# EAGLE design PowerBoard (EAGLE 9.3.0)

## Sheet 1 of 2
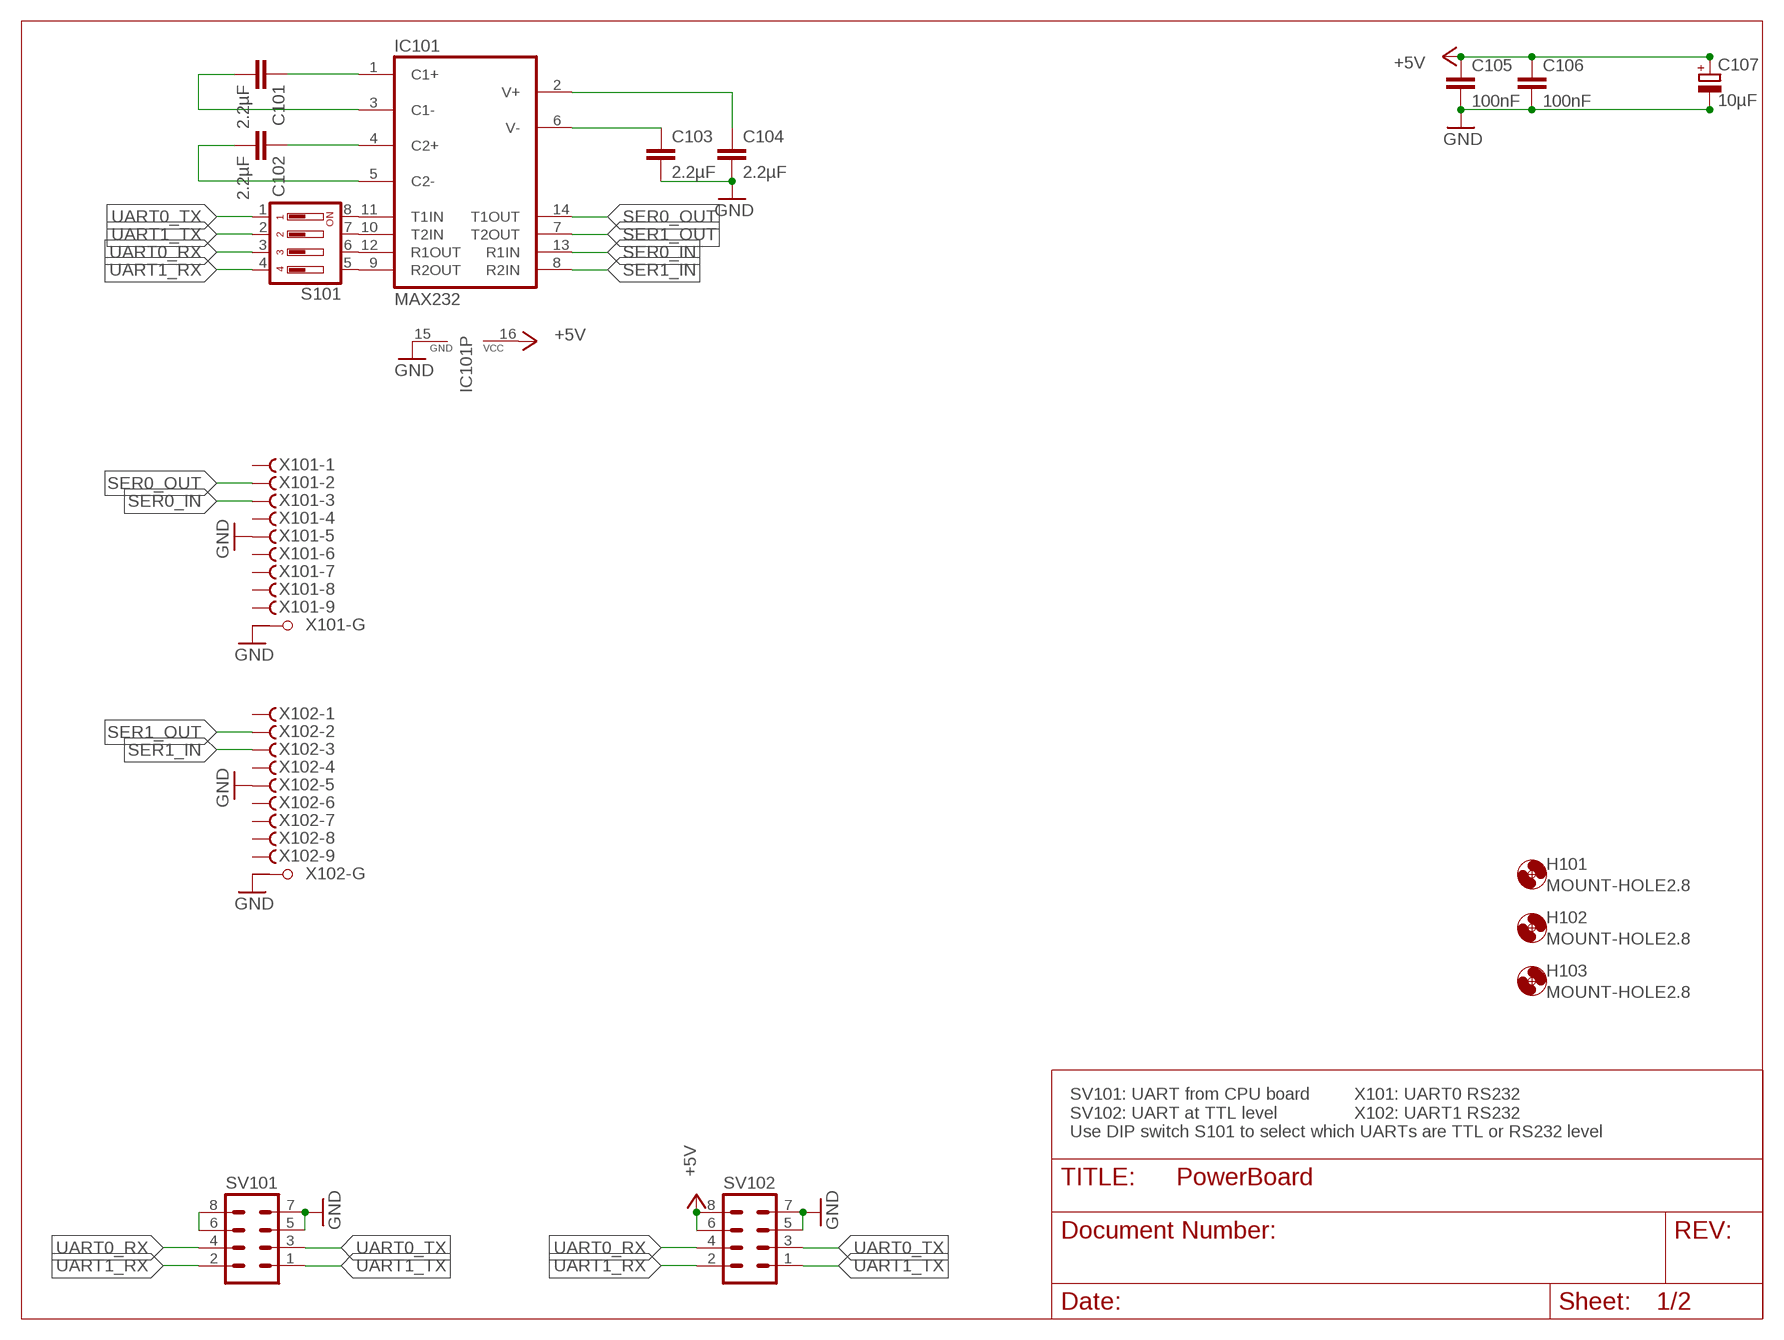
[diagram p0: schematic, sheet 1]

### Parts
C101  2.2µF  C-EUC0805  [C0805]
C102  2.2µF  C-EUC0805  [C0805]
C103  2.2µF  C-EUC0805  [C0805]
C104  2.2µF  C-EUC0805  [C0805]
C105  100nF  C-EUC0805  [C0805]
C106  100nF  C-EUC0805  [C0805]
C107  10µF  CPOL-EUSMCB  [SMC_B]
H101  MOUNT-HOLE2.8  [2,8]
H102  MOUNT-HOLE2.8  [2,8]
H103  MOUNT-HOLE2.8  [2,8]
IC101  MAX232  [DIL16]
S101  DP04  [DP-04]
SV101  MA04-2  [MA04-2]
SV102  MA04-2  [MA04-2]
X101  F09HPS  [F09HP]
X102  F09HPS  [F09HP]

### Nets
+5V: C105.1 C106.1 C107.+ IC101.16(VCC) SV102.6 SV102.8 ; also sheet 2
GND: C103.2 C104.2 C105.2 C106.2 C107.- IC101.15(GND) SV101.5 SV101.7 SV102.5 SV102.7 X101.5(-5:F) X101.G1(-G:G1) X102.5(-5:F) X102.G1(-G:G1) ; also sheet 2
N$1: C104.1 IC101.2(V+)
N$2: C103.1 IC101.6(V-)
N$3: C102.1 IC101.4(C2+)
N$4: C101.1 IC101.1(C1+)
N$5: SV101.6 SV101.8
N$6: IC101.9(R2OUT) S101.5
N$9: C102.2 IC101.5(C2-)
N$10: C101.2 IC101.3(C1-)
N$11: IC101.12(R1OUT) S101.6
N$12: IC101.10(T2IN) S101.7
N$13: IC101.11(T1IN) S101.8
SER0_IN: IC101.13(R1IN) X101.3(-3:F)
SER0_OUT: IC101.14(T1OUT) X101.2(-2:F)
SER1_IN: IC101.8(R2IN) X102.3(-3:F)
SER1_OUT: IC101.7(T2OUT) X102.2(-2:F)
UART0_RX: S101.3 SV101.4 SV102.4
UART0_TX: S101.1 SV101.3 SV102.3
UART1_RX: S101.4 SV101.2 SV102.2
UART1_TX: S101.2 SV101.1 SV102.1
Unconnected: X101.1(-1:F) X101.4(-4:F) X101.6(-6:F) X101.7(-7:F) X101.8(-8:F) X101.9(-9:F) X101.G2(-G:G2) X102.1(-1:F) X102.4(-4:F) X102.6(-6:F) X102.7(-7:F) X102.8(-8:F) X102.9(-9:F) X102.G2(-G:G2)

### Notes on the sheet
- SV101: UART from CPU board
  SV102: UART at TTL level
  Use DIP switch S101 to select which UARTs are TTL or RS232 level
- X101: UART0 RS232
  X102: UART1 RS232

## Sheet 2 of 2
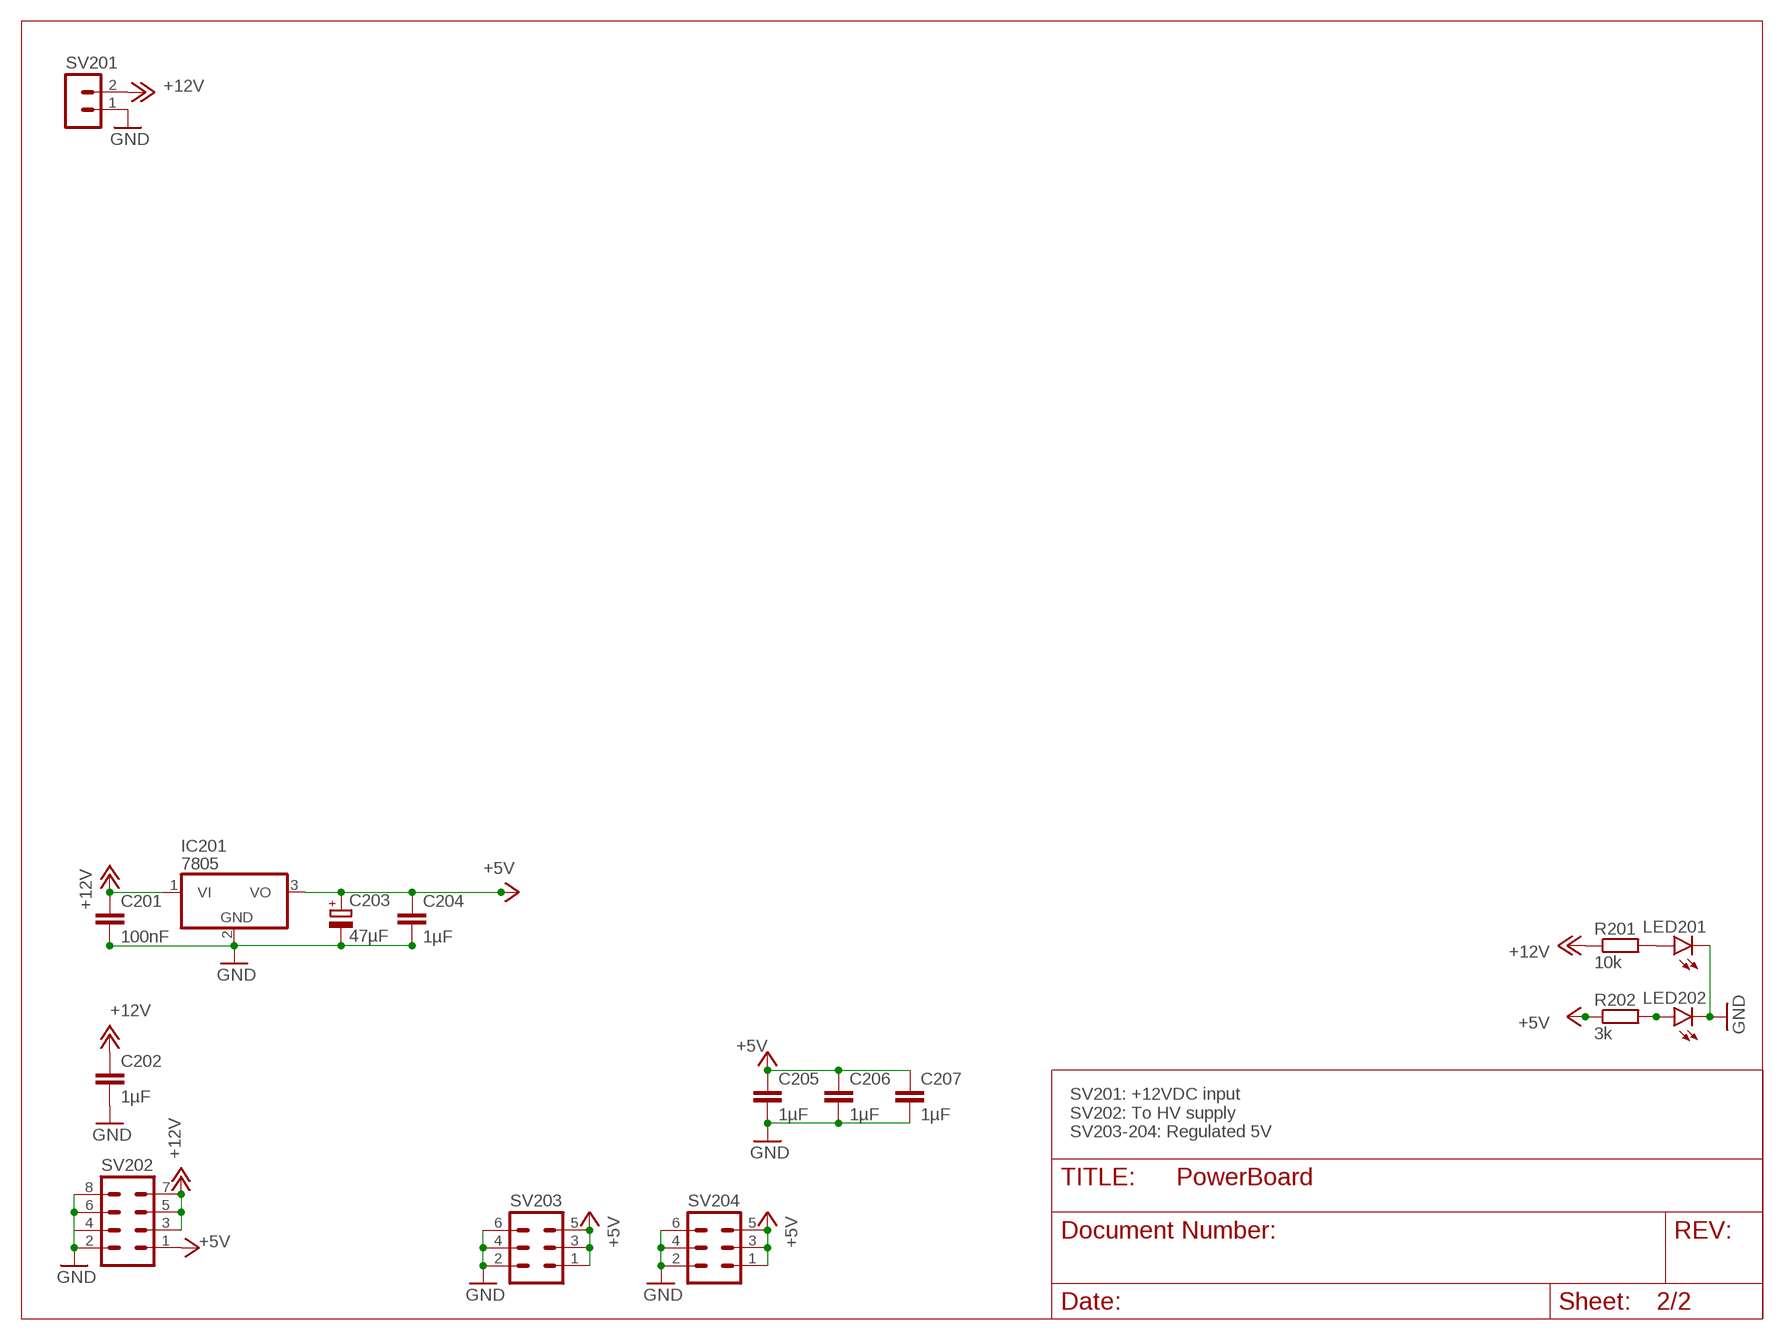
[diagram p1: schematic, sheet 2]

### Parts
C201  100nF  C-EUC0805  [C0805]
C202  1µF  C-EUC0805  [C0805]
C203  47µF  CPOL-EUCT6032  [CT6032]
C204  1µF  C-EUC0805  [C0805]
C205  1µF  C-EUC0805  [C0805]
C206  1µF  C-EUC0805  [C0805]
C207  1µF  C-EUC0805  [C0805]
IC201  7805  7805TV  [TO220V]
LED201  LEDCHIPLED_1206  [CHIPLED_1206]
LED202  LEDCHIPLED_1206  [CHIPLED_1206]
R201  10k  R-EU_R2012  [R2012]
R202  3k  R-EU_R2012  [R2012]
SV201  1792863  [1792863]
SV202  MA04-2  [MA04-2]
SV203  MA03-2  [MA03-2]
SV204  MA03-2  [MA03-2]

### Nets
+5V: C203.+ C204.1 C205.1 C206.1 C207.1 IC201.3(VO) R202.1 SV202.1 SV203.1 SV203.3 SV203.5 SV204.1 SV204.3 SV204.5 ; also sheet 1
+12V: C201.1 C202.1 IC201.1(VI) R201.1 SV201.2 SV202.3 SV202.5 SV202.7
GND: C201.2 C202.2 C203.- C204.2 C205.2 C206.2 C207.2 IC201.2(GND) LED201.C LED202.C SV201.1 SV202.2 SV202.4 SV202.6 SV202.8 SV203.2 SV203.4 SV203.6 SV204.2 SV204.4 SV204.6 ; also sheet 1
N$7: LED202.A R202.2
N$8: LED201.A R201.2

### Notes on the sheet
- SV201: +12VDC input
  SV202: To HV supply
  SV203-204: Regulated 5V

## Library data of the parts
C101-C104 = rcl:C-EU: CAPACITOR, European symbol; MOUSER: 710-885012107016; SPICEPREFIX: C
C105 C106 C201 = rcl:C-EU: CAPACITOR, European symbol; MOUSER: 710-885012207072; SPICEPREFIX: C
C107 = rcl:CPOL-EU: POLARIZED CAPACITOR, European symbol; MOUSER: 581-TAJB106K020RNJV; SPICEPREFIX: C
C202 C204-C207 = rcl:C-EU: CAPACITOR, European symbol; MOUSER: 710-885012107015; SPICEPREFIX: C
C203 = rcl:CPOL-EU: POLARIZED CAPACITOR, European symbol; MOUSER: 581-TAJD476M016RNJV; SPICEPREFIX: C
H101-H103 = holes:MOUNT-HOLE: MOUNTING HOLE with drill center marker
IC101 = maxim:MAX232: RS232 TRANSCEIVER; MF: MAXIM; MOUSER: 595-MAX232N; MPN: MAX232ACPE+; OC_FARNELL: 9723773; OC_NEWARK: 68K4544
IC201 = linear:78*: Positive VOLTAGE REGULATOR Source: http://cache.national.com/ds/LM/LM78L05.pdf http://www.fairchildsemi.com/ds/LM/LM7805.pdf; MOUSER: 490-VXO7805-1000
LED201 LED202 = led:LED: LED OSRAM: - CHIPLED LG R971, LG N971, LY N971, LG Q971, LY Q971, LO R971, LY R971 LH N974, LH R974 LS Q976, LO Q976, LY Q976 LO Q996 - Hyper CHIPLED LW Q18S LB Q993, LB Q99A, LB R99A - SideLED LS A670, LO A670, LY A670, LG A670, LP A670 LB A673, LV A673, LT A673, LW A673 LH A674 LY A675 LS A676, LA A676, LO A676, LY A676, LW A676 LS A679, LY A679, LG A679 - Hyper Micro SIDELED® LS Y876, LA Y876, LO Y876, LY Y876 LT Y87S - SmartLED LW L88C, LW L88S LB L89C, LB L89S, LG L890 LS L89K, LO L89K, LY L89K LS L896, LA L896, LO L896, LY L896 - TOPLED LS T670, LO T670, LY T670, LG T670, LP T670 LSG T670, LSP T670, LSY T670, LOP T670, LYG T670 LG T671, LOG T671, LSG T671 LB T673, LV T673, LT T673, LW T673 LH T674 LS T676, LA T676, LO T676, LY T676, LB T676, LH T676, LSB T676, LW T676 LB T67C, LV T67C, LT T67C, LS T67K, LO T67K, LY T67K, LW E67C LS E67B, LA E67B, LO E67B, LY E67B, LB E67C, LV E67C, LT E67C LW T67C LS T679, LY T679, LG T679 LS T770, LO T770, LY T770, LG T770, LP T770 LB T773, LV T773, LT T773, LW T773 LH T774 LS E675, LA E675, LY E675, LS T675 LS T776, LA T776, LO T776, LY T776, LB T776 LHGB T686 LT T68C, LB T68C - Hyper Mini TOPLED® LB M676 - Mini TOPLED Santana® LG M470 LS M47K, LO M47K, LY M47K Source: http://www.osram.convergy.de LUXEON: - LUMILED® LXK2-PW12-R00, LXK2-PW12-S00, LXK2-PW14-U00, LXK2-PW14-V00 LXK2-PM12-R00, LXK2-PM12-S00, LXK2-PM14-U00 LXK2-PE12-Q00, LXK2-PE12-R00, LXK2-PE12-S00, LXK2-PE14-T00, LXK2-PE14-U00 LXK2-PB12-K00, LXK2-PB12-L00, LXK2-PB12-M00, LXK2-PB14-N00, LXK2-PB14-P00, LXK2-PB14-Q00 LXK2-PR12-L00, LXK2-PR12-M00, LXK2-PR14-Q00, LXK2-PR14-R00 LXK2-PD12-Q00, LXK2-PD12-R00, LXK2-PD12-S00 LXK2-PH12-R00, LXK2-PH12-S00 LXK2-PL12-P00, LXK2-PL12-Q00, LXK2-PL12-R00 Source: www.luxeon.com KINGBRIGHT: KA-3528ASYC Source: www.kingbright.com; MOUSER: 710-156120YS75300
R201 = rcl:R-EU_: RESISTOR, European symbol; MOUSER: 652-CR0805FX-1002ELF; SPICEPREFIX: R
R202 = rcl:R-EU_: RESISTOR, European symbol; MOUSER: 652-CR0805JW-302ELF; SPICEPREFIX: R
S101 = switch-dil:DP04: DIL/CODE SWITCH; MOUSER: 611-BDB04; MPN: DP04; OC_FARNELL: 9471600; OC_NEWARK: 73J0027
SV101 SV102 SV202 = con-lstb:MA04-2: PIN HEADER; OC_FARNELL: unknown; OC_NEWARK: unknown
SV201 = Parts:1792863: PCB terminal block - PTS 1,5/ 2-5,0-H - 1792863 Footprint Proven Information <https://www.phoenixcontact.com/online/portal/us?uri=pxc-oc-itemdetail:pid=1792863&library=usen&tab=1>; MOUSER: 651-1792863
SV203 SV204 = con-lstb:MA03-2: PIN HEADER; OC_FARNELL: unknown; OC_NEWARK: unknown
X101 X102 = con-subd:F09HPS: SUB-D; OC_FARNELL: unknown; OC_NEWARK: unknown

## Net classes
0 default: width 0.203 mm

## Board
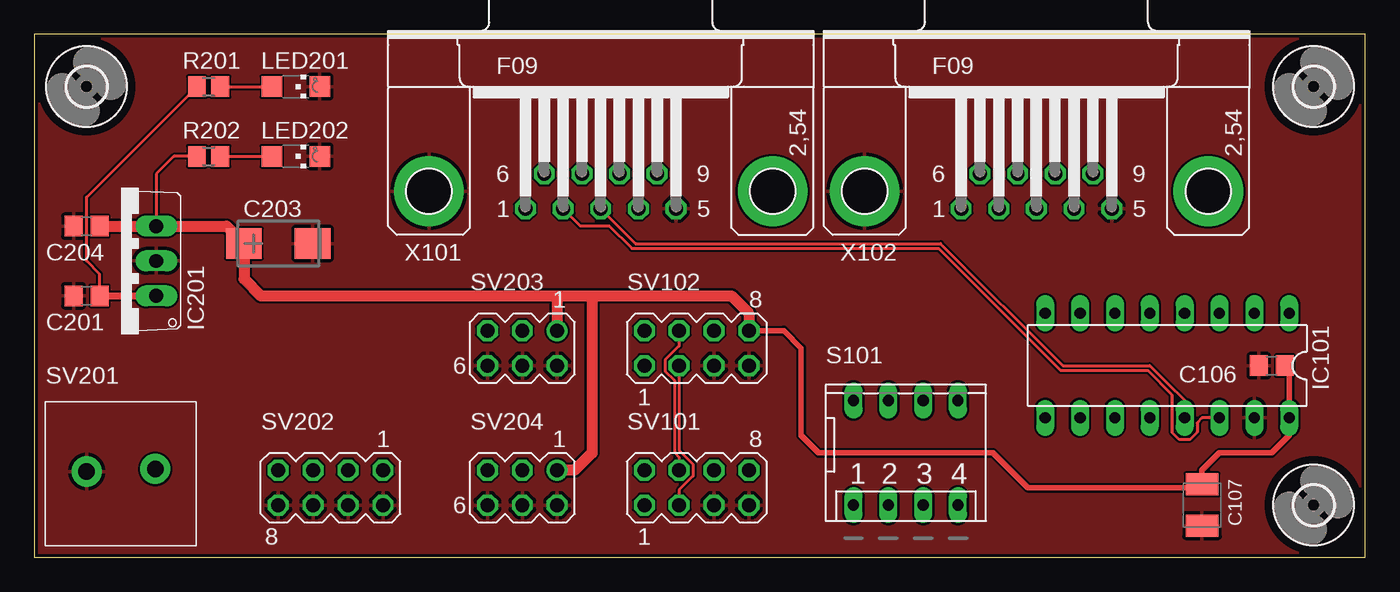
[diagram p2: board, top side]
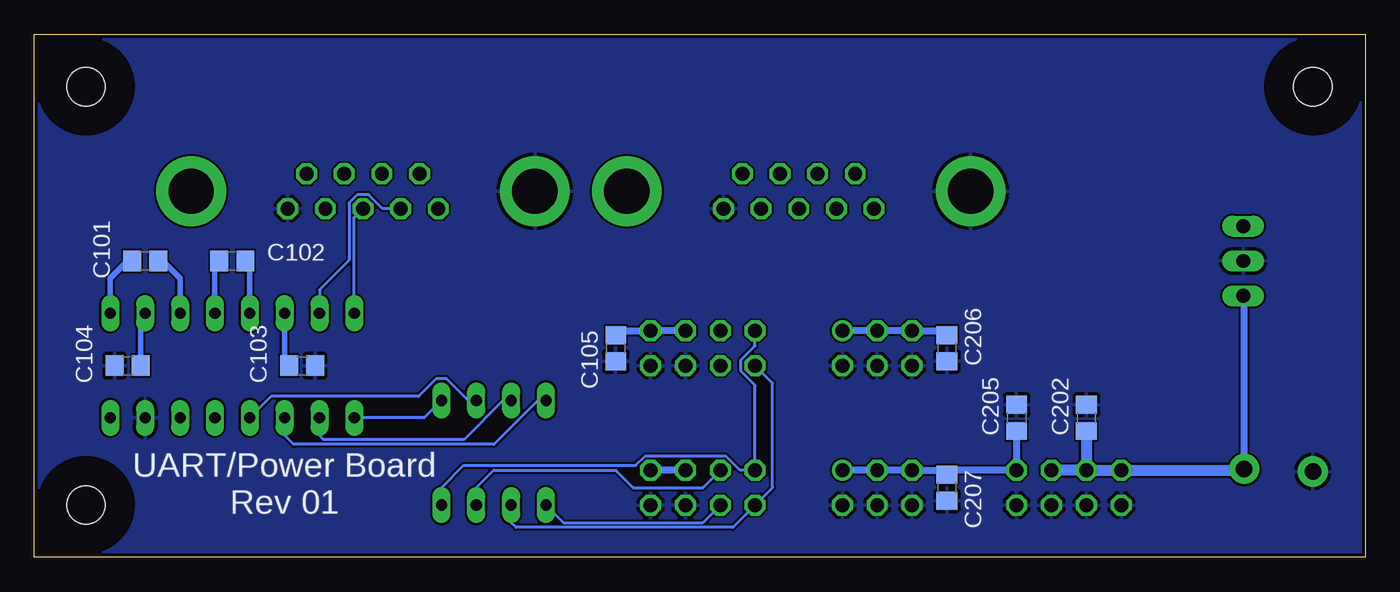
[diagram p3: board, bottom side, seen from below]

Size 96.98 x 38.1 mm. Coordinates in mm from the lower left corner, seen from the top.
Outline: 0,0 96.98,0 96.98,38.1 0,38.1 0,0
Copper layers (1*16): Top 0.035mm / dielectric 1.5mm / Bottom 0.035mm
Design rules "dirt_cheap_dirty_boards.v1.1": minimum track width 6mil, minimum drill 12mil, track to track 6mil, track to pad 6mil, pad to pad 6mil, via to via 6mil, smd to smd 0mil, copper to edge 10mil, drill to drill 10mil, minimum pad ring 10mil, minimum via ring 6mil, stop-mask expansion 2mil, vias tented up to drill 25mil, thermal gap 10mil

### Footprints (pad centres in the part's own frame; a part is rotated, then mirrored left to right if it is on the bottom)
C0805 = smd 1.3 x 1.5: 1 -0.95,0; 2 0.95,0
SMC_B = smd 1.6 x 2.4: + -1.5,0; - 1.5,0
CT6032 = smd 2.6 x 2.2: + -2.5,0; - 2.5,0
2,8 = hole 2.8: 0,0
DIL16 = drill 0.813 long: 1 -8.89,-3.81; 2 -6.35,-3.81; 3 -3.81,-3.81; 4 -1.27,-3.81; 5 1.27,-3.81; 6 3.81,-3.81; 7 6.35,-3.81; 8 8.89,-3.81; 9 8.89,3.81; 10 6.35,3.81; 11 3.81,3.81; 12 1.27,3.81; 13 -1.27,3.81; 14 -3.81,3.81; 15 -6.35,3.81; 16 -8.89,3.81
TO220V = drill 1.016 long: 1 -2.54,-2.54; 2 0,-2.54; 3 2.54,-2.54
CHIPLED_1206 = smd 1.5 x 1.5: A 0,-1.75; C 0,1.75
R2012 = smd 1.3 x 1.5: 1 -0.85,0; 2 0.85,0
DP-04 = drill 0.813 long: 1 -3.81,-3.81; 2 -1.27,-3.81; 3 1.27,-3.81; 4 3.81,-3.81; 5 3.81,3.81; 6 1.27,3.81; 7 -1.27,3.81; 8 -3.81,3.81
MA04-2 = drill 1.016 octagon: 1 -3.81,-1.27; 2 -3.81,1.27; 3 -1.27,-1.27; 4 -1.27,1.27; 5 1.27,-1.27; 6 1.27,1.27; 7 3.81,-1.27; 8 3.81,1.27
1792863 = drill 1.2 pad 2.2: 1 0,-0.1; 2 5,0.1
MA03-2 = drill 1.016: 1 -2.54,-1.27 | drill 1.016 octagon: 2 -2.54,1.27; 3 0,-1.27; 4 0,1.27; 5 2.54,-1.27; 6 2.54,1.27
F09HP = drill 1.016 octagon: 1 -5.486,-1.27; 2 -2.743,-1.27; 3 0,-1.27; 4 2.743,-1.27; 5 5.486,-1.27; 6 -4.115,1.27; 7 -1.372,1.27; 8 1.372,1.27; 9 4.115,1.27 | drill 3.302 pad 5.08: G1 -12.522,0; G2 12.522,0

### Placement (x,y rotation side)
C101  88.9,21.59 0 bottom
C102  82.55,21.59 0 bottom
C103  77.47,13.97 0 bottom
C104  90.17,13.97 180 bottom
C105  54.61,15.24 270 bottom
C106  90.17,13.97 180 top
C107  85.09,3.81 270 top
C201  3.81,19.05 180 top
C202  20.32,10.16 90 bottom
C203  17.78,22.86 0 top
C204  3.81,24.13 180 top
C205  25.4,10.16 90 bottom
C206  30.48,15.24 270 bottom
C207  30.48,5.08 270 bottom
H101  3.81,34.29 0 top
H102  93.22,34.29 0 top
H103  93.22,3.81 0 top
IC101  82.55,13.97 180 top
IC201  6.35,21.59 90 top
LED201  19.05,34.29 270 top
LED202  19.05,29.21 270 top
R201  12.7,34.29 0 top
R202  12.7,29.21 0 top
S101  63.5,7.62 0 top
SV101  48.26,5.08 0 top
SV102  48.26,15.24 0 top
SV201  3.81,6.35 0 top
SV202  21.59,5.08 180 top
SV203  35.56,15.24 180 top
SV204  35.56,5.08 180 top
X101  41.27,26.67 0 top
X102  73.03,26.67 0 top

### Tracks (layer width: path | path; a pad name or v marks a point on that pad's centre or on a via)
+5V
  Top 0.203: R202.1 10.16,29.21 8.89,27.94 IC201.3
  Top 0.406: C106.1 91.44,13.65 IC101.16 91.44,8.89 90.17,7.62 86.36,7.62 85.09,6.35 C107.+ 84.86,5.08 72.39,5.08 69.85,7.62 57.15,7.62 55.88,8.89 55.88,15.24 54.61,16.51 SV102.8
  Top 0.813: C204.1 IC201.3 14.01,24.13 C203.+ 15.28,20.28 16.51,19.05 38.1,19.05 | SV102.8 52.07,17.78 50.8,19.05 40.64,19.05 | 38.1,19.05 40.64,19.05 | 38.1,19.05 SV203.1 | 40.64,19.05 40.64,7.62 39.37,6.35 SV204.1
  Bottom 0.508: SV203.1 SV203.3 SV203.5 30.48,16.51 C206.1 | 30.64,6.19 30.8,6.35 SV204.5 SV204.3 SV204.1 | 30.64,6.19 C207.1 | 30.64,6.19 30.48,6.35 SV202.1 C205.1 | SV102.6 SV102.8 54.29,16.51 C105.1
+12V
  Top 0.203: R201.1 3.81,26.25 3.81,21.59 4.76,20.64 C201.1
  Top 0.508: C201.1 IC201.1
  Bottom 0.508: 8.91,6.35 SV201.2 8.81,18.97 IC201.1
  Bottom 0.813: C202.1 SV202.5 | SV202.5 SV202.3 | SV202.5 SV202.7 8.91,6.35
GND
  pour Top: 0,0 0,38.1 96.98,38.1 96.98,0
  pour Bottom: 0,0 0,38.1 96.98,38.1 96.98,0
N$1
  Bottom 0.406: C104.1 89.22,17.46 IC101.2
N$2
  Bottom 0.203: C103.1 78.74,14.29
  Bottom 0.406: 78.74,14.29 IC101.6
N$3
  Bottom 0.406: C102.1 83.82,21.27 IC101.4
N$4
  Bottom 0.203: 90.17,21.59 C101.1
  Bottom 0.406: IC101.1 91.44,20.32 90.17,21.59
N$5
  Bottom 0.508: SV101.6 SV101.8
N$6
  Bottom 0.203: S101.5 68.58,10.16 IC101.9
N$7
  Top 0.203: R202.2 LED202.A
N$8
  Top 0.203: R201.2 LED201.A
N$9
  Bottom 0.203: 81.44,21.43 C102.2
  Bottom 0.406: IC101.5 81.28,21.27 81.44,21.43
N$10
  Bottom 0.203: 87.63,21.59 C101.2
  Bottom 0.406: IC101.3 86.36,20.32 87.63,21.59
N$11
  Bottom 0.203: S101.6 65.36,11.43 66.93,13.01 67.69,13.01 68.96,11.73 79.7,11.73 IC101.12
N$12
  Bottom 0.203: S101.7 62.82,11.43 65.66,8.59 75.89,8.59 76.2,8.89 IC101.10
N$13
  Bottom 0.203: S101.8 60.28,11.43 63.48,8.23 78.08,8.23 78.74,8.89 IC101.11
SER0_IN
  Top 0.203: X101.3 43.81,22.86 66.04,22.86 74.93,13.97 81.28,13.97 82.55,12.7 83.82,11.43 IC101.13
SER0_OUT
  Top 0.203: X101.2 39.8,24.13 41.91,24.13 43.54,22.5 65.89,22.5 74.78,13.61 81.13,13.61 82.91,11.84 82.91,9.12 83.44,8.59 84.2,8.59 84.73,9.12 84.73,9.8 85.09,10.16 IC101.14
SER1_IN
  Bottom 0.203: IC101.8 73.66,24.77 X102.3
SER1_OUT
  Bottom 0.203: IC101.7 76.2,19.48 74.04,21.64 74.04,25.82 73.45,26.42 72.6,26.42 71.59,25.4 X102.2
UART0_RX
  Top 0.203: SV102.4 46.99,15.41 45.97,14.39 45.97,13.55 46.63,12.89 46.63,7.64 46.99,7.28 SV101.4
  Bottom 0.203: S101.3 64.77,5.08 63.5,6.35 54.61,6.35 53.34,5.08 48.26,5.08 SV101.4
UART0_TX
  Top 0.203: SV102.3 46.99,7.79 48.01,6.77 48.01,5.93 46.99,4.91 SV101.3
  Bottom 0.203: SV101.3 48.26,2.54 58.42,2.54 S101.1
UART1_RX
  Bottom 0.203: S101.4 67.31,5.08 65.68,6.71 53.15,6.71 52.49,7.37 46.57,7.37 45.55,6.35 SV101.2 44.45,12.53 45.47,13.55 45.47,14.39 44.45,15.41 SV102.2
UART1_TX
  Bottom 0.203: S101.2 62.23,2.54 61.87,2.18 46.08,2.18 SV101.1 43.18,5.08 43.18,12.7 SV102.1

### Text on the board
bNames: UART/Power Board / Rev 01